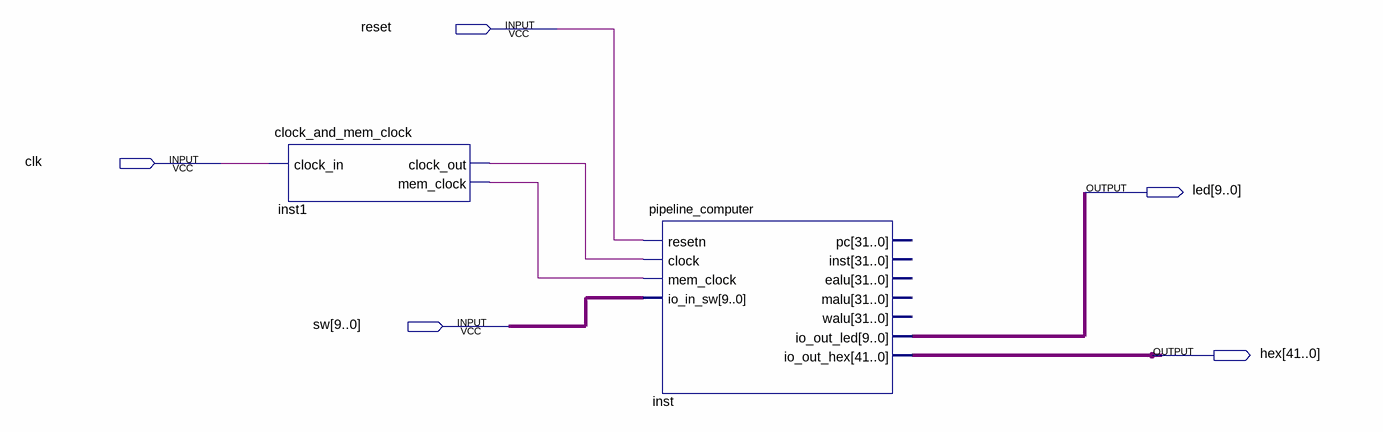
[diagram p0: schematic sheet]
// Quartus schematic pp_computer.bdf as structural Verilog: 2 symbols, 5 pins
module pp_computer (
  input  reset,
  input  clk,
  input  [9:0] sw,
  output [9:0] led,
  output [41:0] hex
);

  wire inst1_clock_out, inst1_mem_clock;

  clock_and_mem_clock inst1 (.clock_in(clk), .clock_out(inst1_clock_out), .mem_clock(inst1_mem_clock));
  pipeline_computer inst (
    .resetn(reset), .clock(inst1_clock_out), .mem_clock(inst1_mem_clock), .io_in_sw(sw), .io_out_led(led),
    .io_out_hex(hex));  // open: pc, inst, ealu, malu, walu
endmodule
